# EAGLE design I2CRJ45X8 (EAGLE 9.6.2)

## Sheet 1 of 4
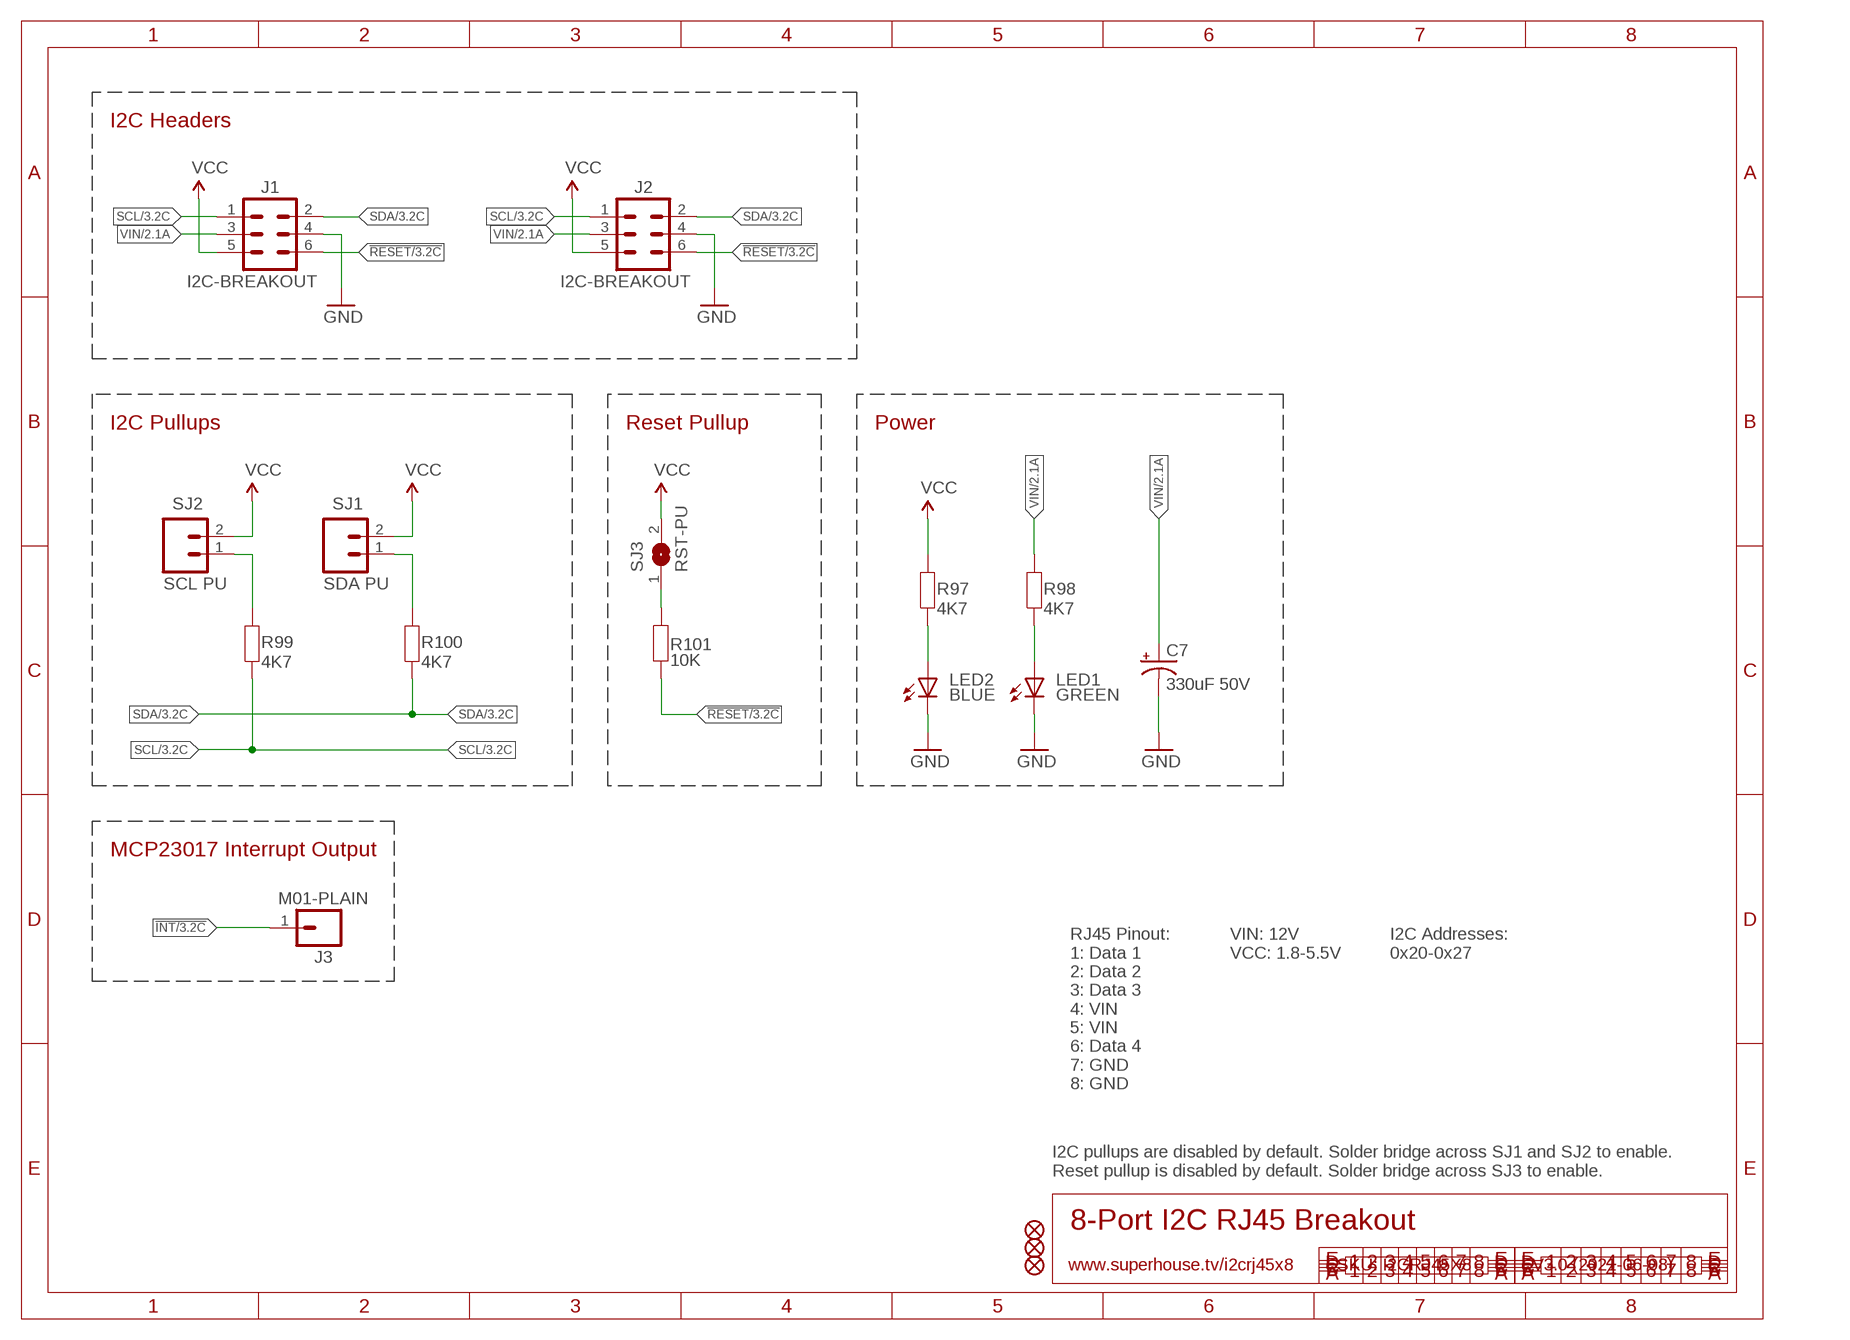
[diagram p0: schematic, sheet 1]

### Parts
C7  330uF 50V  CAP_POLG  [PANASONIC_G]
FID1  FIDUCIAL1X2.5  [FIDUCIAL-1X2.5]
FID2  FIDUCIAL1X2.5  [FIDUCIAL-1X2.5]
FID3  FIDUCIAL1X2.5  [FIDUCIAL-1X2.5]
J1  I2C-BREAKOUT  M02X3-SHROUDED  [2X3-2.54-SHROUDED]
J2  I2C-BREAKOUT  M02X3-SHROUDED  [2X3-2.54-SHROUDED]
J3  M01-PLAIN  [1X01]
LED1  GREEN  LED0603  [LED-0603]
LED2  BLUE  LED0603  [LED-0603]
R97  4K7  RESISTOR0603  [R0603]
R98  4K7  RESISTOR0603  [R0603]
R99  4K7  RESISTOR0603  [R0603]
R100  4K7  RESISTOR0603  [R0603]
R101  10K  RESISTOR0603  [R0603]
SJ1  SDA PU  M02-PIN  [1X02-P]
SJ2  SCL PU  M02-PIN  [1X02-P]
SJ3  RST-PU  SJ-NORMAL  [SJ]

### Nets
!INT: J3.1 ; also sheet 3,4
!RESET: J1.6 J2.6 R101.1 ; also sheet 3,4
GND: C7.- J1.4 J2.4 LED1.C LED2.C ; also sheet 2,3,4
N$1: R99.2 SJ2.1
N$2: R100.2 SJ1.1
N$3: R101.2 SJ3.1
N$7: LED2.A R97.1
N$8: LED1.A R98.1
SCL: J1.1 J2.1 R99.1 ; also sheet 3,4
SDA: J1.2 J2.2 R100.1 ; also sheet 3,4
VCC: J1.5 J2.5 R97.2 SJ1.2 SJ2.2 SJ3.2 ; also sheet 3,4
VIN: C7.+ J1.3 J2.3 R98.2 ; also sheet 2

### Notes on the sheet
- I2C Headers
- I2C Pullups | Reset Pullup | Power
- MCP23017 Interrupt Output
- RJ45 Pinout:
  1: Data 1
  2: Data 2
  3: Data 3
  4: VIN
  5: VIN
  6: Data 4
  7: GND
  8: GND
- VIN: 12V
  VCC: 1.8-5.5V
- I2C Addresses:
  0x20-0x27
- I2C pullups are disabled by default. Solder bridge across SJ1 and SJ2 to enable.
  Reset pullup is disabled by default. Solder bridge across SJ3 to enable.
- 8-Port I2C RJ45 Breakout
- www.superhouse.tv/i2crj45x8 | SKU: I2CRJ45X8 | V3.0 (2021-06-08)

## Sheet 2 of 4
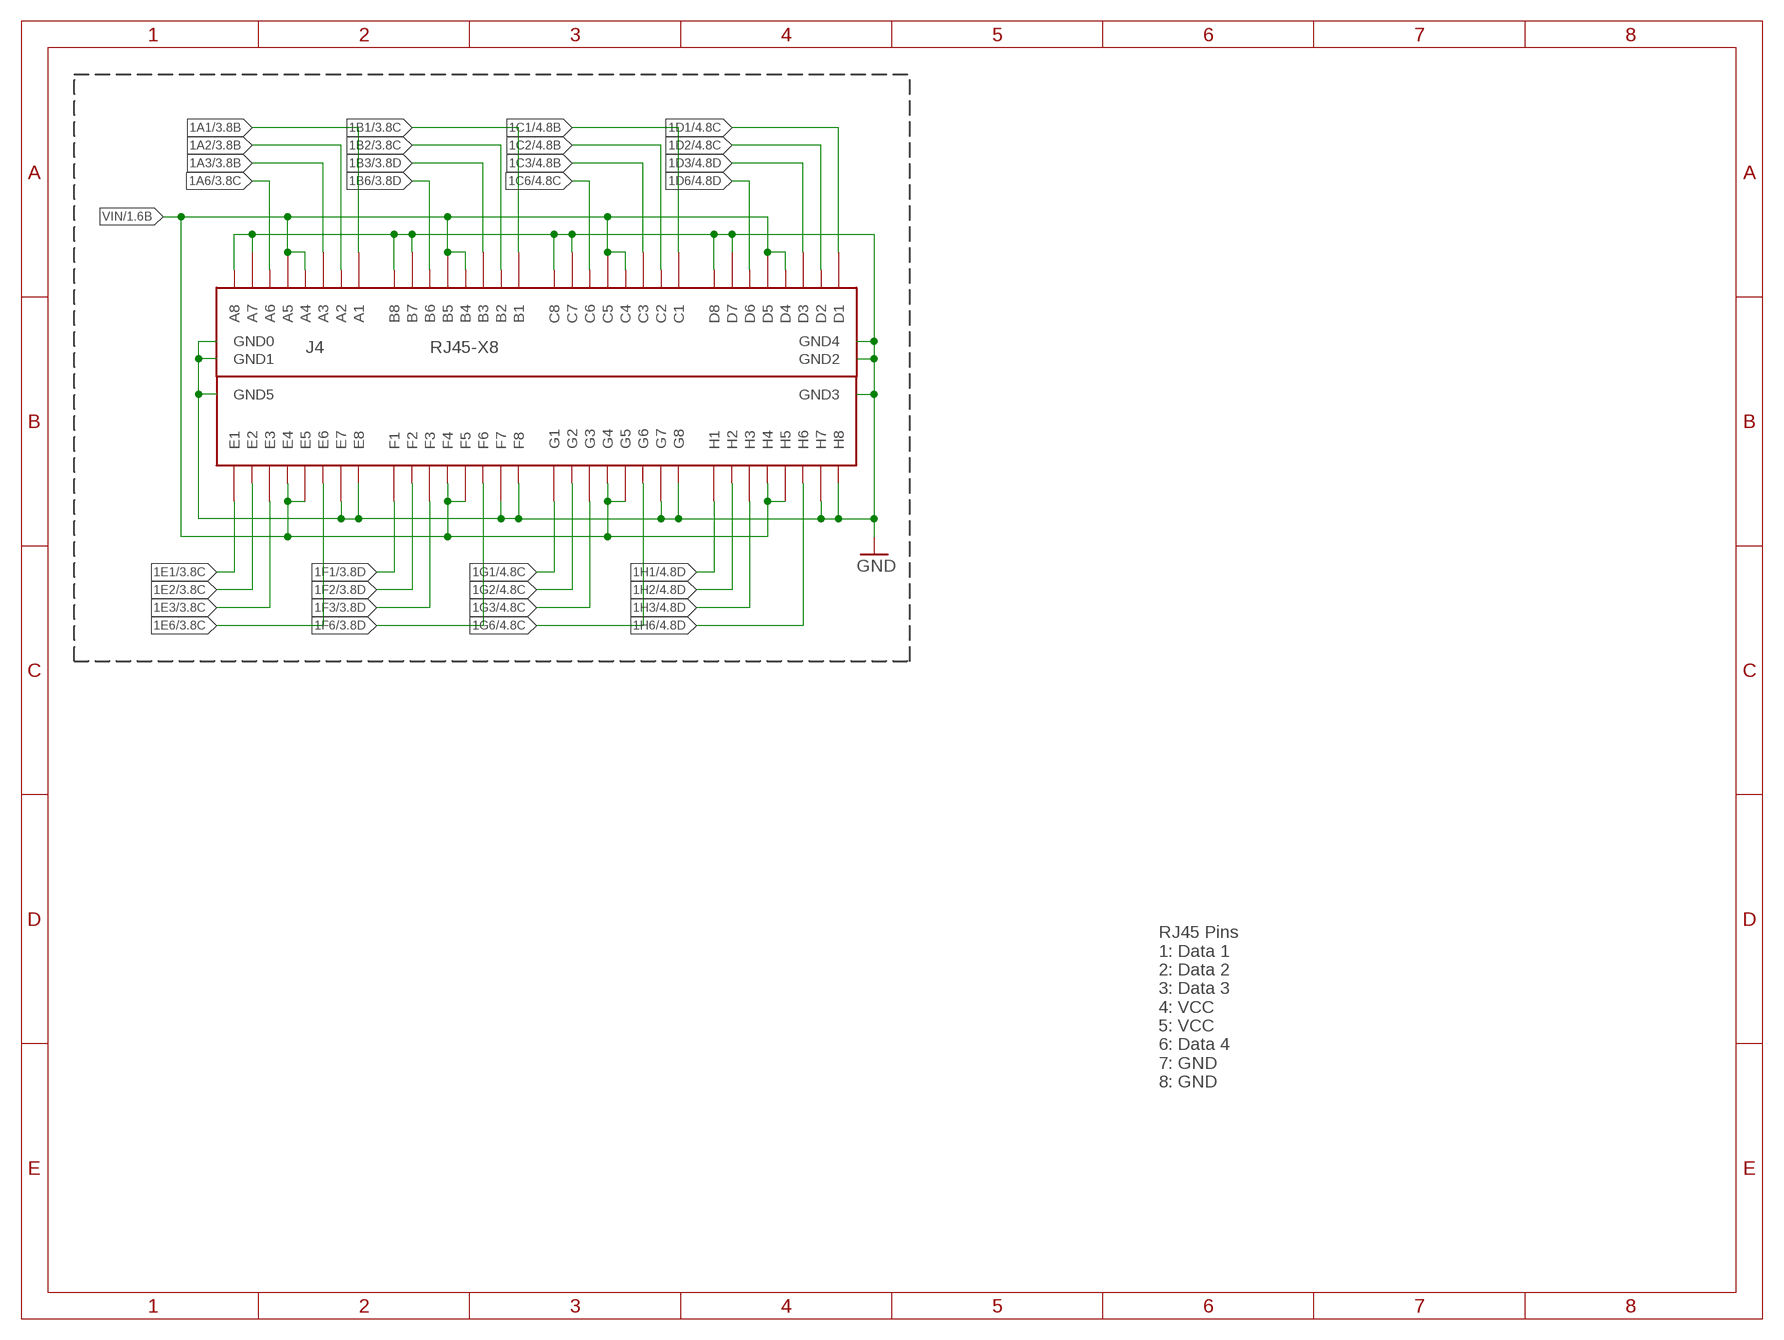
[diagram p1: schematic, sheet 2]

### Parts
J4  RJ45-X8  [RJ45-2X4]

### Nets
1A1: J4.A1 ; also sheet 3
1A2: J4.A2 ; also sheet 3
1A3: J4.A3 ; also sheet 3
1A6: J4.A6 ; also sheet 3
1B1: J4.B1 ; also sheet 3
1B2: J4.B2 ; also sheet 3
1B3: J4.B3 ; also sheet 3
1B6: J4.B6 ; also sheet 3
1C1: J4.C1 ; also sheet 4
1C2: J4.C2 ; also sheet 4
1C3: J4.C3 ; also sheet 4
1C6: J4.C6 ; also sheet 4
1D1: J4.D1 ; also sheet 4
1D2: J4.D2 ; also sheet 4
1D3: J4.D3 ; also sheet 4
1D6: J4.D6 ; also sheet 4
1E1: J4.E1 ; also sheet 3
1E2: J4.E2 ; also sheet 3
1E3: J4.E3 ; also sheet 3
1E6: J4.E6 ; also sheet 3
1F1: J4.F1 ; also sheet 3
1F2: J4.F2 ; also sheet 3
1F3: J4.F3 ; also sheet 3
1F6: J4.F6 ; also sheet 3
1G1: J4.G1 ; also sheet 4
1G2: J4.G2 ; also sheet 4
1G3: J4.G3 ; also sheet 4
1G6: J4.G6 ; also sheet 4
1H1: J4.H1 ; also sheet 4
1H2: J4.H2 ; also sheet 4
1H3: J4.H3 ; also sheet 4
1H6: J4.H6 ; also sheet 4
GND: J4.A7 J4.A8 J4.B7 J4.B8 J4.C7 J4.C8 J4.D7 J4.D8 J4.E7 J4.E8 J4.F7 J4.F8 J4.G7 J4.G8 J4.GND0 J4.GND1 J4.GND2 J4.GND3 J4.GND4 J4.GND5 J4.H7 J4.H8 ; also sheet 1,3,4
VIN: J4.A4 J4.A5 J4.B4 J4.B5 J4.C4 J4.C5 J4.D4 J4.D5 J4.E4 J4.E5 J4.F4 J4.F5 J4.G4 J4.G5 J4.H4 J4.H5 ; also sheet 1

### Notes on the sheet
- RJ45 Pins
  1: Data 1
  2: Data 2
  3: Data 3
  4: VCC
  5: VCC
  6: Data 4
  7: GND
  8: GND

## Sheet 3 of 4
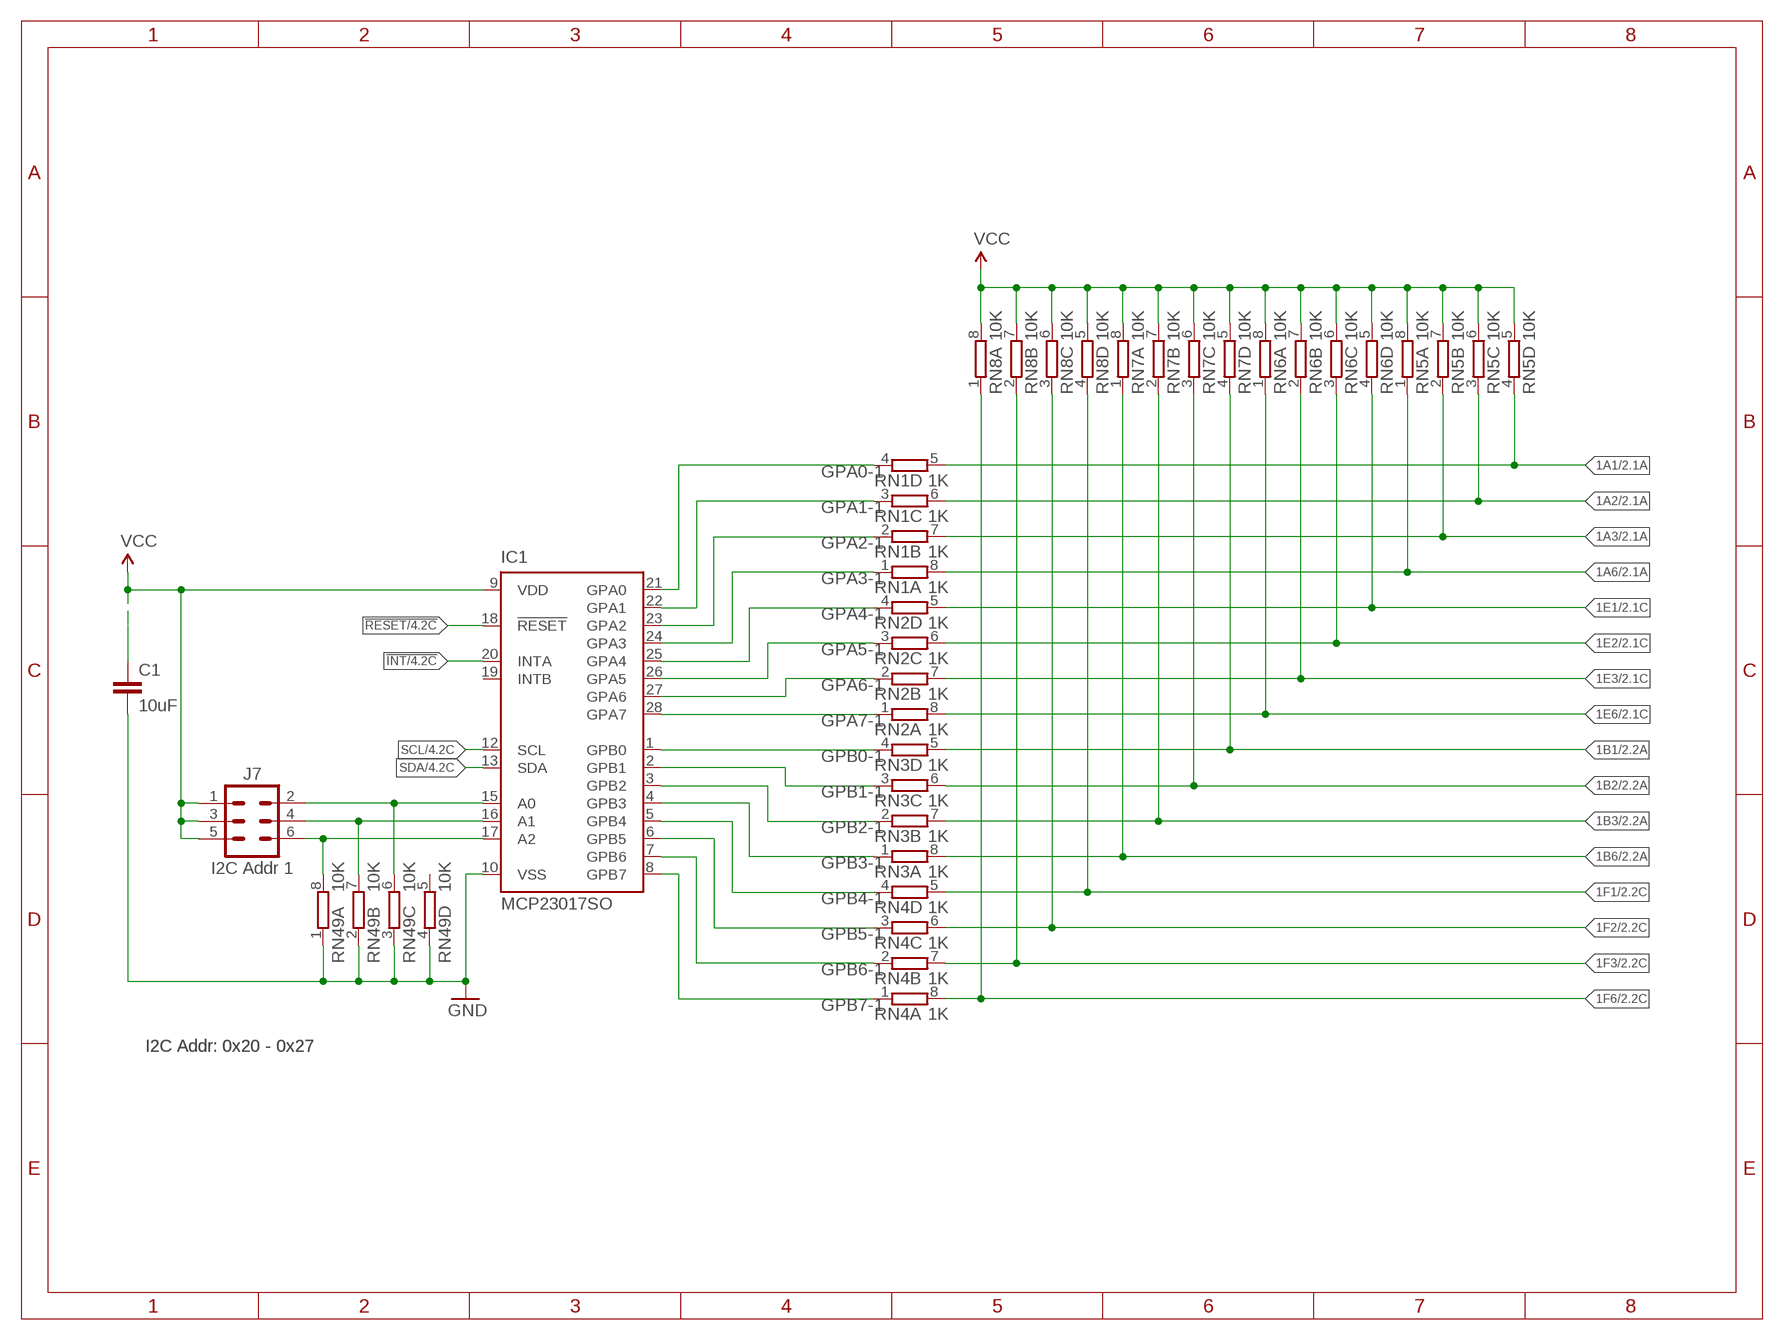
[diagram p2: schematic, sheet 3]

### Parts
C1  10uF  CAP0805  [C0805]
IC1  MCP23017SO  [SO28W]
J7  I2C Addr 1  M02X3-PIN  [2X03-P]
RN1  1K  4R-NCAY16  [CAY16]
RN2  1K  4R-NCAY16  [CAY16]
RN3  1K  4R-NCAY16  [CAY16]
RN4  1K  4R-NCAY16  [CAY16]
RN5  10K  4R-NCAY16  [CAY16]
RN6  10K  4R-NCAY16  [CAY16]
RN7  10K  4R-NCAY16  [CAY16]
RN8  10K  4R-NCAY16  [CAY16]
RN49  10K  4R-NCAY16  [CAY16]

### Nets
1A1: RN1.5 RN5.4 ; also sheet 2
1A2: RN1.6 RN5.3 ; also sheet 2
1A3: RN1.7 RN5.2 ; also sheet 2
1A6: RN1.8 RN5.1 ; also sheet 2
1B1: RN3.5 RN7.4 ; also sheet 2
1B2: RN3.6 RN7.3 ; also sheet 2
1B3: RN3.7 RN7.2 ; also sheet 2
1B6: RN3.8 RN7.1 ; also sheet 2
1E1: RN2.5 RN6.4 ; also sheet 2
1E2: RN2.6 RN6.3 ; also sheet 2
1E3: RN2.7 RN6.2 ; also sheet 2
1E6: RN2.8 RN6.1 ; also sheet 2
1F1: RN4.5 RN8.4 ; also sheet 2
1F2: RN4.6 RN8.3 ; also sheet 2
1F3: RN4.7 RN8.2 ; also sheet 2
1F6: RN4.8 RN8.1 ; also sheet 2
!INT: IC1.20(INTA) ; also sheet 1,4
!RESET: IC1.18(!RESET) ; also sheet 1,4
GND: C1.2 IC1.10(VSS) RN49.1 RN49.2 RN49.3 RN49.4 ; also sheet 1,2,4
GPA0-1: IC1.21(GPA0) RN1.4
GPA1-1: IC1.22(GPA1) RN1.3
GPA2-1: IC1.23(GPA2) RN1.2
GPA3-1: IC1.24(GPA3) RN1.1
GPA4-1: IC1.25(GPA4) RN2.4
GPA5-1: IC1.26(GPA5) RN2.3
GPA6-1: IC1.27(GPA6) RN2.2
GPA7-1: IC1.28(GPA7) RN2.1
GPB0-1: IC1.1(GPB0) RN3.4
GPB1-1: IC1.2(GPB1) RN3.3
GPB2-1: IC1.3(GPB2) RN3.2
GPB3-1: IC1.4(GPB3) RN3.1
GPB4-1: IC1.5(GPB4) RN4.4
GPB5-1: IC1.6(GPB5) RN4.3
GPB6-1: IC1.7(GPB6) RN4.2
GPB7-1: IC1.8(GPB7) RN4.1
N$4: IC1.17(A2) J7.6 RN49.8
N$5: IC1.16(A1) J7.4 RN49.7
N$6: IC1.15(A0) J7.2 RN49.6
SCL: IC1.12(SCL) ; also sheet 1,4
SDA: IC1.13(SDA) ; also sheet 1,4
VCC: C1.1 IC1.9(VDD) J7.1 J7.3 J7.5 RN5.5 RN5.6 RN5.7 RN5.8 RN6.5 RN6.6 RN6.7 RN6.8 RN7.5 RN7.6 RN7.7 RN7.8 RN8.5 RN8.6 RN8.7 RN8.8 ; also sheet 1,4
Unconnected: IC1.19(INTB) RN49.5

### Notes on the sheet
- I2C Addr: 0x20 - 0x27 | I2C Addr: 0x20 - 0x27

## Sheet 4 of 4
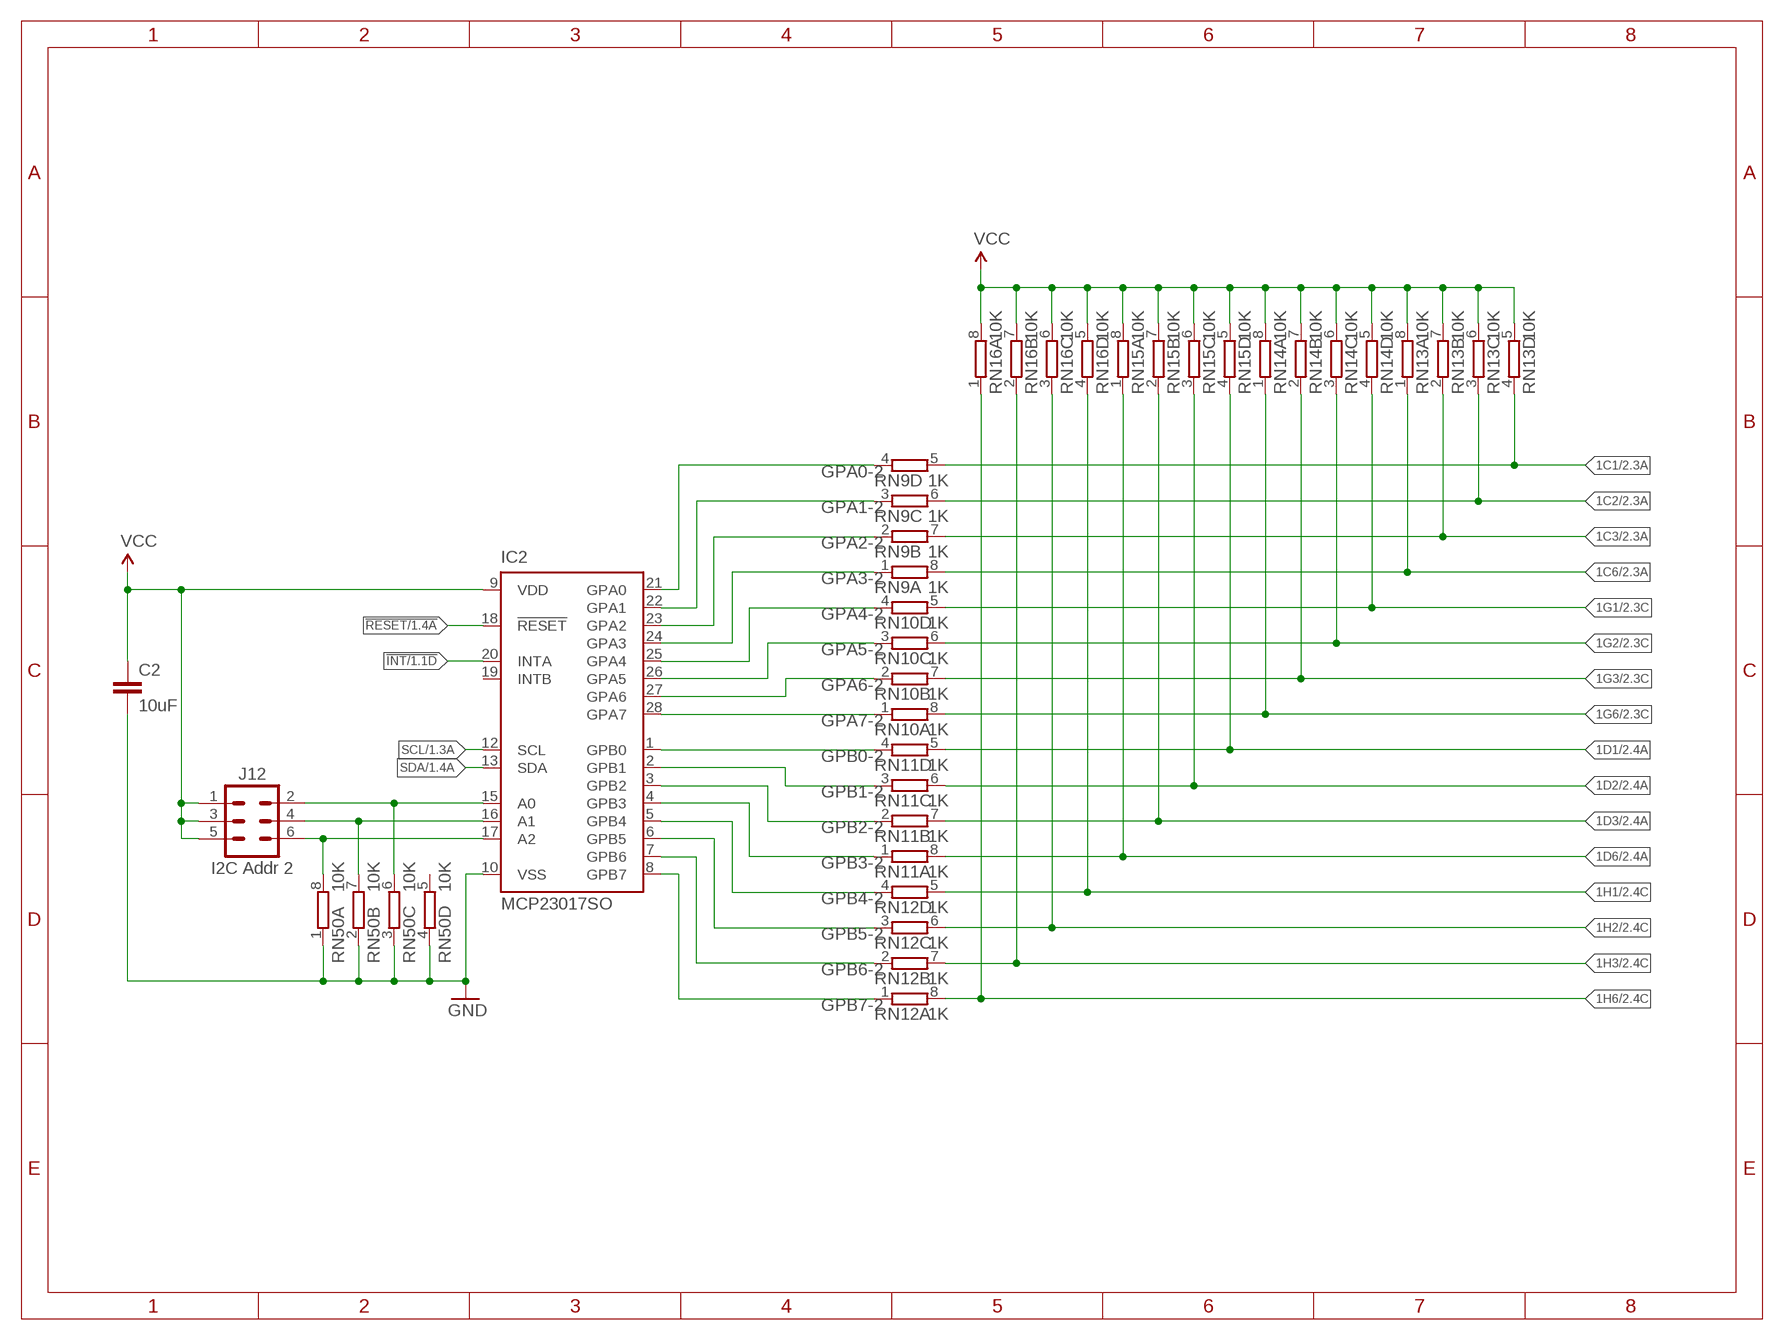
[diagram p3: schematic, sheet 4]

### Parts
C2  10uF  CAP0805  [C0805]
IC2  MCP23017SO  [SO28W]
J12  I2C Addr 2  M02X3-PIN  [2X03-P]
RN9  1K  4R-NCAY16  [CAY16]
RN10  1K  4R-NCAY16  [CAY16]
RN11  1K  4R-NCAY16  [CAY16]
RN12  1K  4R-NCAY16  [CAY16]
RN13  10K  4R-NCAY16  [CAY16]
RN14  10K  4R-NCAY16  [CAY16]
RN15  10K  4R-NCAY16  [CAY16]
RN16  10K  4R-NCAY16  [CAY16]
RN50  10K  4R-NCAY16  [CAY16]

### Nets
1C1: RN9.5 RN13.4 ; also sheet 2
1C2: RN9.6 RN13.3 ; also sheet 2
1C3: RN9.7 RN13.2 ; also sheet 2
1C6: RN9.8 RN13.1 ; also sheet 2
1D1: RN11.5 RN15.4 ; also sheet 2
1D2: RN11.6 RN15.3 ; also sheet 2
1D3: RN11.7 RN15.2 ; also sheet 2
1D6: RN11.8 RN15.1 ; also sheet 2
1G1: RN10.5 RN14.4 ; also sheet 2
1G2: RN10.6 RN14.3 ; also sheet 2
1G3: RN10.7 RN14.2 ; also sheet 2
1G6: RN10.8 RN14.1 ; also sheet 2
1H1: RN12.5 RN16.4 ; also sheet 2
1H2: RN12.6 RN16.3 ; also sheet 2
1H3: RN12.7 RN16.2 ; also sheet 2
1H6: RN12.8 RN16.1 ; also sheet 2
!INT: IC2.20(INTA) ; also sheet 1,3
!RESET: IC2.18(!RESET) ; also sheet 1,3
GND: C2.2 IC2.10(VSS) RN50.1 RN50.2 RN50.3 RN50.4 ; also sheet 1,2,3
GPA0-2: IC2.21(GPA0) RN9.4
GPA1-2: IC2.22(GPA1) RN9.3
GPA2-2: IC2.23(GPA2) RN9.2
GPA3-2: IC2.24(GPA3) RN9.1
GPA4-2: IC2.25(GPA4) RN10.4
GPA5-2: IC2.26(GPA5) RN10.3
GPA6-2: IC2.27(GPA6) RN10.2
GPA7-2: IC2.28(GPA7) RN10.1
GPB0-2: IC2.1(GPB0) RN11.4
GPB1-2: IC2.2(GPB1) RN11.3
GPB2-2: IC2.3(GPB2) RN11.2
GPB3-2: IC2.4(GPB3) RN11.1
GPB4-2: IC2.5(GPB4) RN12.4
GPB5-2: IC2.6(GPB5) RN12.3
GPB6-2: IC2.7(GPB6) RN12.2
GPB7-2: IC2.8(GPB7) RN12.1
N$9: IC2.15(A0) J12.2 RN50.6
N$10: IC2.16(A1) J12.4 RN50.7
N$11: IC2.17(A2) J12.6 RN50.8
SCL: IC2.12(SCL) ; also sheet 1,3
SDA: IC2.13(SDA) ; also sheet 1,3
VCC: C2.1 IC2.9(VDD) J12.1 J12.3 J12.5 RN13.5 RN13.6 RN13.7 RN13.8 RN14.5 RN14.6 RN14.7 RN14.8 RN15.5 RN15.6 RN15.7 RN15.8 RN16.5 RN16.6 RN16.7 RN16.8 ; also sheet 1,3
Unconnected: IC2.19(INTB) RN50.5

## Library data of the parts
C1 C2 = SuperHouse-Capacitors:CAP: Capacitor Standard ceramic capacitor
C7 = SuperHouse-Capacitors:CAP_POL: Capacitor Polarized These are standard SMD and PTH capacitors. Normally 10uF, 47uF, and 100uF in electrolytic and tantalum varieties. Always verify the external diameter of the through hole cap, it varies with capacity, voltage, and manufacturer. The EIA devices should be standard.
FID1-FID3 = SuperHouse-Symbols:FIDUCIAL: Fiducial Alignment Points Various fiducial points for machine vision alignment.
IC1 IC2 = SuperHouse-ICs:MCP23017: http://ww1.microchip.com/downloads/en/DeviceDoc/21952a.pdf Source: http://ww1.microchip.com/downloads/en/DeviceDoc/21952a.pdf
J1 J2 J7 J12 = SuperHouse-Connectors:M02X3: M6 header in 2x3 format
J3 = SuperHouse-Connectors:M01: 1-way header Standard 1x1 header
J4 = SuperHouse-Connectors:RJ45-X8: 8-way RJ45 socket, PCB mount. 2 rows of 4.
LED1 LED2 = SuperHouse-LEDs:LED: LEDs in various sizes including 5mm and 3mm PTH, and 0402, 0603, 0805, etc SMT
R97-R101 = SuperHouse-Resistors:RESISTOR: Resistors in both surface-mount and through-hole versions.
RN1-RN16 RN49 RN50 = SuperHouse-Resistors:4R-N: Array Chip Resistor Source: RS Component / Phycomp
SJ1 SJ2 = SuperHouse-Connectors:M02: 2-way header Standard 1x2 header, and screw terminal variations
SJ3 = SuperHouse-Jumpers:SJ: SMD solder jumper, normally-open. Add solder to close the connection.

## Board
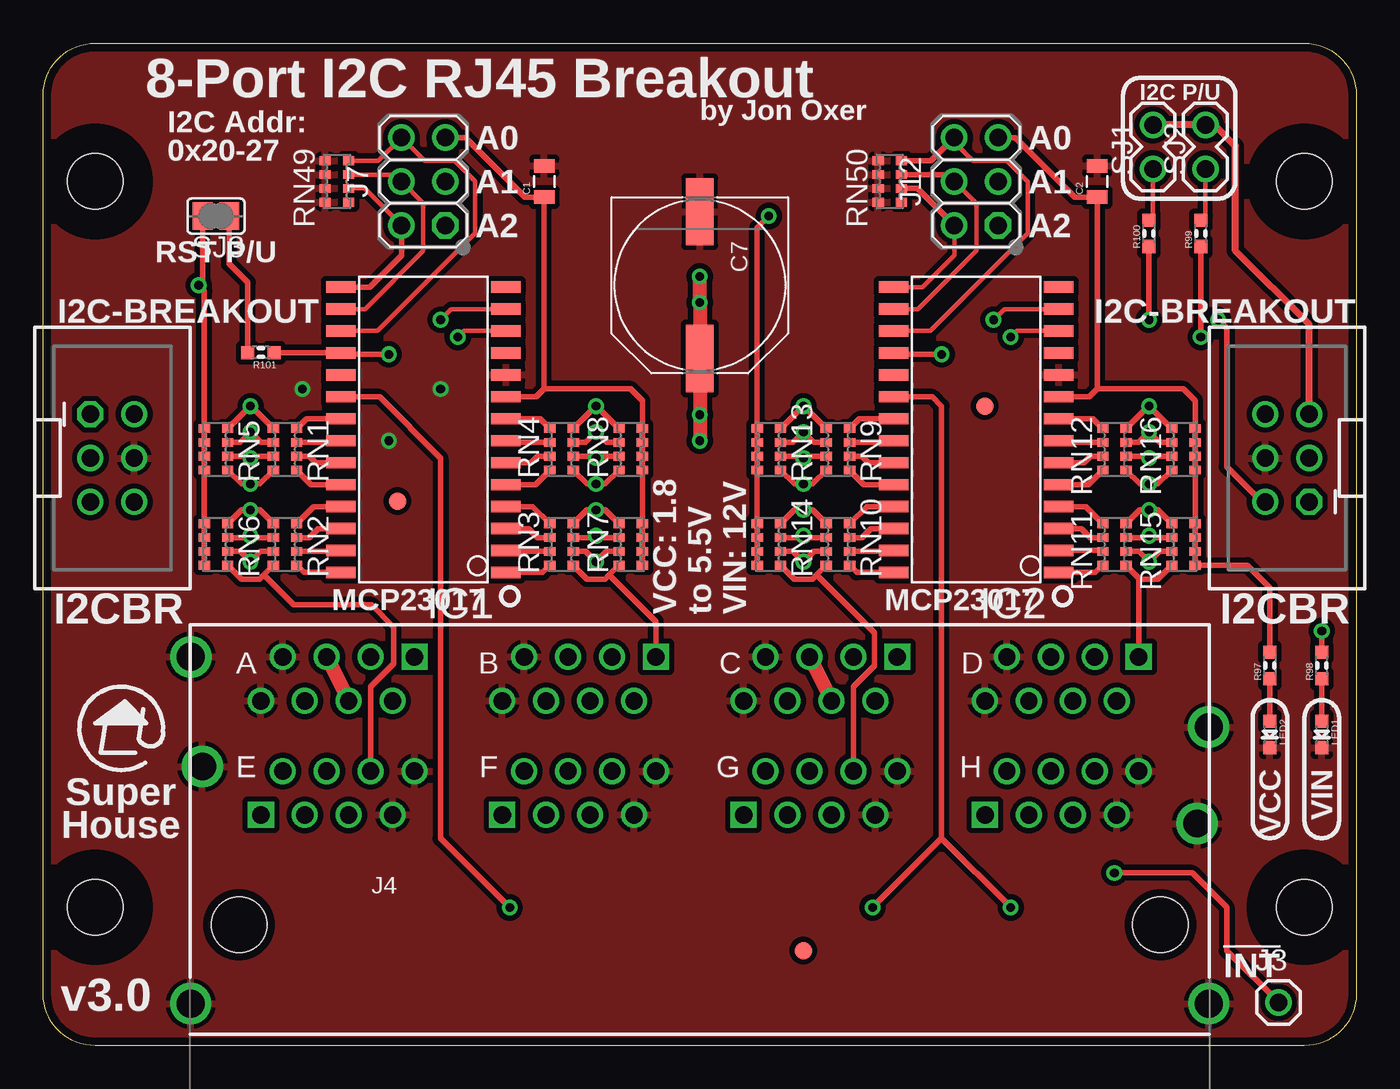
[diagram p4: board, top side]
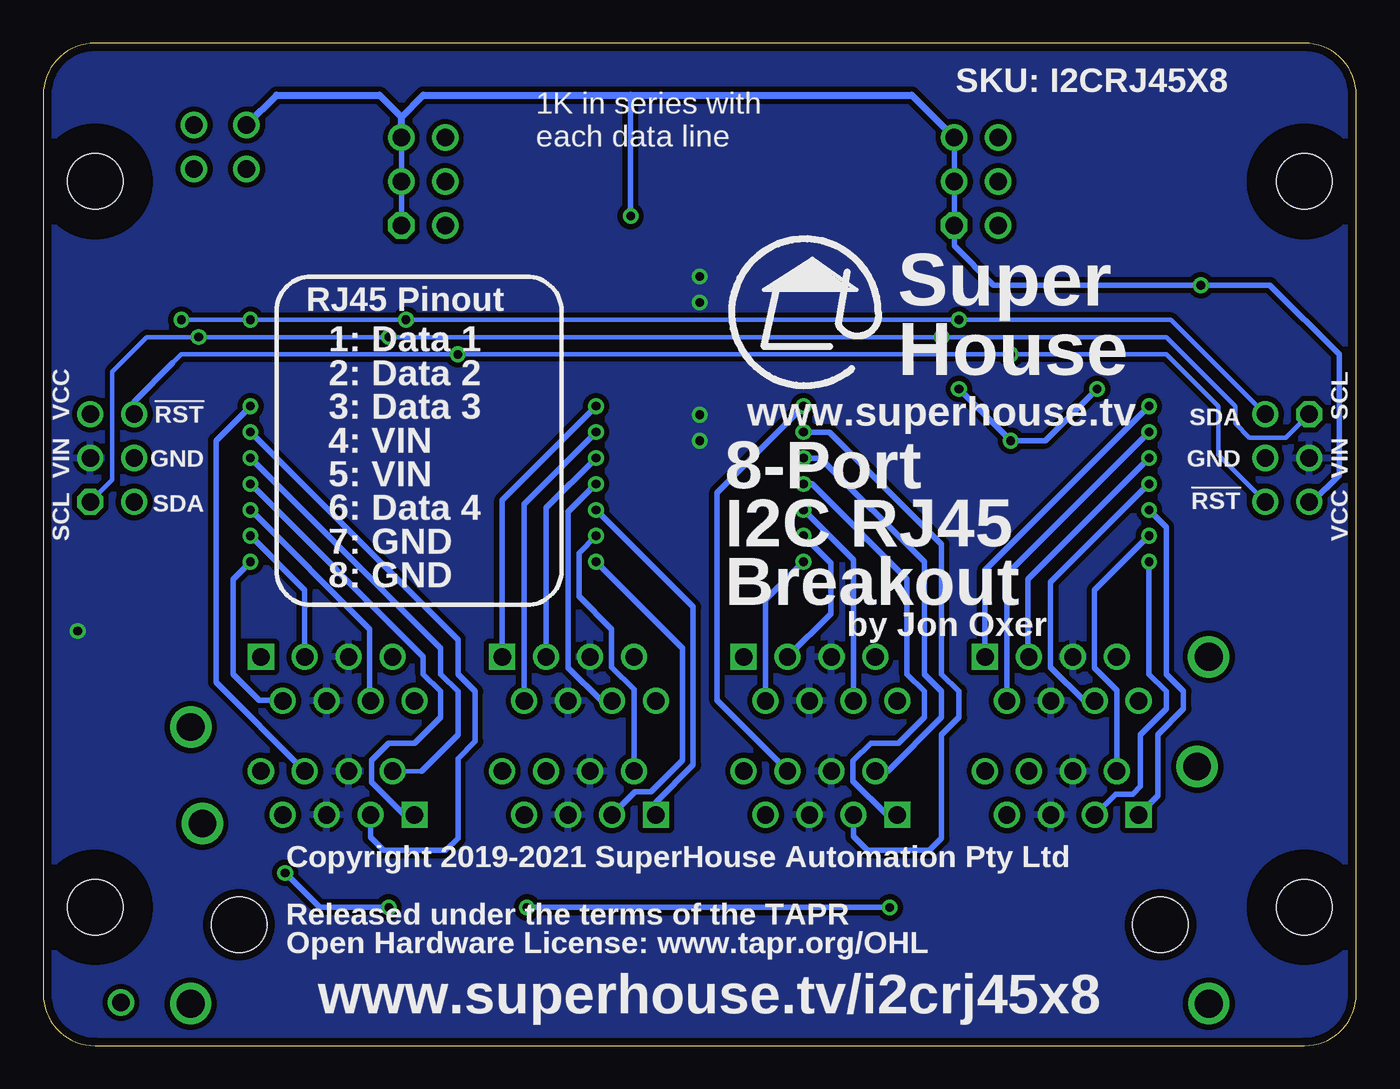
[diagram p5: board, bottom side, seen from below]

Size 76 x 58 mm. Coordinates in mm from the lower left corner, seen from the top.
Outline: 3,0 arc-90 0,3 0,55 arc-90 3,58 73,58 arc-90 76,55 76,3 arc-90 73,0 3,0
Copper layers (1*16): Top 0.035mm / dielectric 1.5mm / Bottom 0.035mm
Design rules "default *": minimum track width 10mil, minimum drill 0.5mm, track to track 12mil, track to pad 12mil, pad to pad 12mil, via to via 12mil, smd to smd 8mil, copper to edge 18mil, drill to drill 8mil, minimum pad ring 10mil, minimum via ring 8mil, stop-mask expansion 4mil, vias tented up to drill 25mil, thermal gap 10mil
Holes 3.2 mm at 3,8 73,8 73,50 3,50
tRestrict: area -0.2,4.8 to 6.2,11.2; area 69.8,4.8 to 76.2,11.2; area 69.8,46.8 to 76.2,53.2; area -0.2,46.8 to 6.2,53.2
bRestrict: area -0.2,4.8 to 6.2,11.2; area 69.8,4.8 to 76.2,11.2; area 69.8,46.8 to 76.2,53.2; area -0.2,46.8 to 6.2,53.2

### Footprints (pad centres in the part's own frame; a part is rotated, then mirrored left to right if it is on the bottom)
C0805 = smd 0.8 x 1.2: 1 -0.9,0; 2 0.9,0
PANASONIC_G = smd 3.9 x 1.6: + 4.25,0; - -4.25,0
FIDUCIAL-1X2.5 = smd 1 x 1: 1 0,0
SO28W = smd 0.65 x 1.7: 1 -7.62,-4.78; 2 -6.35,-4.78; 3 -5.08,-4.78; 4 -3.81,-4.78; 5 -2.54,-4.78; 6 -1.27,-4.78; 7 0,-4.78; 8 1.27,-4.78; 9 2.54,-4.78; 10 3.81,-4.78; 11 5.08,-4.78; 12 6.35,-4.78; 13 7.62,-4.78; 14 8.89,-4.78; 15 8.89,4.78; 16 7.62,4.78; 17 6.35,4.78; 18 5.08,4.78; 19 3.81,4.78; 20 2.54,4.78; 21 1.27,4.78; 22 0,4.78; 23 -1.27,4.78; 24 -2.54,4.78; 25 -3.81,4.78; 26 -5.08,4.78; 27 -6.35,4.78; 28 -7.62,4.78
2X3-2.54-SHROUDED = drill 1 octagon: 1 -2.54,-1.27 | drill 1: 2 -2.54,1.27; 3 0,-1.27; 4 0,1.27; 5 2.54,-1.27; 6 2.54,1.27
1X01 = drill 1.016: 1 0,0
RJ45-2X4 = drill 1 square: A1 -16.51,15.49; B1 -2.54,15.49; C1 11.43,15.49; D1 25.4,15.49; E1 -25.4,6.35; F1 -11.43,6.35; G1 2.54,6.35; H1 16.51,6.35 | drill 1: A2 -17.78,12.95; A3 -19.05,15.49; A4 -20.32,12.95; A5 -21.59,15.49; A6 -22.86,12.95; A7 -24.13,15.49; A8 -25.4,12.95; B2 -3.81,12.95; B3 -5.08,15.49; B4 -6.35,12.95; B5 -7.62,15.49; B6 -8.89,12.95; B7 -10.16,15.49; B8 -11.43,12.95; C2 10.16,12.95; C3 8.89,15.49; C4 7.62,12.95; C5 6.35,15.49; C6 5.08,12.95; C7 3.81,15.49; C8 2.54,12.95; D2 24.13,12.95; D3 22.86,15.49; D4 21.59,12.95; D5 20.32,15.49; D6 19.05,12.95; D7 17.78,15.49; D8 16.51,12.95; E2 -24.13,8.89; E3 -22.86,6.35; E4 -21.59,8.89; E5 -20.32,6.35; E6 -19.05,8.89; E7 -17.78,6.35; E8 -16.51,8.89; F2 -10.16,8.89; F3 -8.89,6.35; F4 -7.62,8.89; F5 -6.35,6.35; F6 -5.08,8.89; F7 -3.81,6.35; F8 -2.54,8.89; G2 3.81,8.89; G3 5.08,6.35; G4 6.35,8.89; G5 7.62,6.35; G6 8.89,8.89; G7 10.16,6.35; G8 11.43,8.89; H2 17.78,8.89; H3 19.05,6.35; H4 20.32,8.89; H5 21.59,6.35; H6 22.86,8.89; H7 24.13,6.35; H8 25.4,8.89 | drill 1.6: GND0 29.464,-4.572; GND1 28.79,5.85; GND2 -29.46,15.5; GND3 -28.79,9.15; GND4 -29.464,-4.572; GND5 29.46,11.43 | hole 3.2: 26.67,0; -26.67,0
2X03-P = drill 1.016 octagon: 1 -2.54,-1.27 | drill 1.016: 2 -2.54,1.27; 3 0,-1.27; 4 0,1.27; 5 2.54,-1.27; 6 2.54,1.27
LED-0603 = smd 0.762 x 0.762: A -0.762,0; C 0.762,0
R0603 = smd 0.762 x 0.762: 1 -0.762,0; 2 0.762,0
CAY16 = smd 0.5 x 0.65: 1 -1.2,-0.675; 2 -0.4,-0.675; 3 0.4,-0.675; 4 1.2,-0.675; 5 1.2,0.675; 6 0.4,0.675; 7 -0.4,0.675; 8 -1.2,0.675
1X02-P = drill 1.016: 1 -1.27,0; 2 1.27,0
SJ = smd 1.168 x 1.6: 1 -0.762,0; 2 0.762,0

### Placement (x,y rotation side)
C1  29,50 90 top
C2  61,50 90 top
C7  38,44 270 top
FID1  20.5,31.5 0 top
FID2  54.5,37 0 top
FID3  44,5.5 0 top
IC1  22,35 90 top
IC2  54,35 90 top
J1  4,34 270 top
J2  72,34 90 top
J3  71.5,2.5 0 top
J4  38,7 0 top
J7  22,50 90 top
J12  54,50 90 top
LED1  74,18 270 top
LED2  71,18 270 top
R97  71,22 90 top
R98  74,22 90 top
R99  67,47 90 top
R100  64,47 90 top
R101  12.6,40.1 180 top
RN1  14,34.5 90 top
RN2  14,29 90 top
RN3  30,29 270 top
RN4  30,34.5 270 top
RN5  10,34.5 90 top
RN6  10,29 90 top
RN7  34,29 270 top
RN8  34,34.5 270 top
RN9  46,34.5 90 top
RN10  46,29 90 top
RN11  62,29 270 top
RN12  62,34.5 270 top
RN13  42,34.5 90 top
RN14  42,29 90 top
RN15  66,29 270 top
RN16  66,34.5 270 top
RN49  17,50 270 top
RN50  49,50 270 top
SJ1  64.23,52 90 top
SJ2  67.27,52 90 top
SJ3  10,48 180 top

### Tracks (layer width: path | path; a pad name or v marks a point on that pad's centre or on a via)
1A1  (via drill 0.5)
  Top 0.305: RN1.5 12.03,37 v12,37 11.97,37 RN5.4
  Bottom 0.305: v12,37 21.49,27.51 J4.A1
1A2  (via drill 0.5)
  Top 0.305: RN1.6 12.6,34.9 v12,35.5 11.4,34.9 RN5.3
  Bottom 0.305: v12,35.5 20.22,27.28 J4.A2
1A3  (via drill 0.5)
  Top 0.305: RN1.7 12.1,34.1 v12,34 11.9,34.1 RN5.2
  Bottom 0.254: J4.A3 19,22.54
  Bottom 0.305: v12,34 19,27 19,22.54
1A6  (via drill 0.5)
  Top 0.305: RN1.8 12.53,32.5 v12,32.5 11.47,32.5 RN5.1
  Bottom 0.305: v12,32.5 17.7,26.8 17.7,21.9 15.75,19.95 J4.A6
1B1
  Top 0.305: RN3.5 31.48,27 32.52,27 32.76,27.24 | RN7.4 32.76,27.24 | J4.B1 35.46,24.54 32.76,27.24
1B2  (via drill 0.5)
  Top 0.305: RN3.6 31.4,28.6 v32,28 32.6,28.6 RN7.3
  Bottom 0.305: J4.B2 34.19,25.81 v32,28
1B3  (via drill 0.5)
  Top 0.305: RN3.7 31.9,29.4 v32,29.5 32.1,29.4 RN7.2
  Bottom 0.305: v32,29.5 30.42,27.92 30.42,24.99 J4.B3
1B6  (via drill 0.5)
  Top 0.305: RN3.8 31.48,31 v32,31 32.52,31 RN7.1
  Bottom 0.305: J4.B6 29.11,28.11 v32,31
1C1  (via drill 0.5)
  Top 0.305: RN9.5 44.02,37 v44,37 43.98,37 RN13.4
  Bottom 0.305: v44,37 49.43,31.57 J4.C1
1C2  (via drill 0.5)
  Top 0.305: RN9.6 44.6,34.9 v44,35.5 43.4,34.9 RN13.3
  Bottom 0.254: J4.C2 48.18,19.97
  Bottom 0.305: v44,35.5 48.18,31.32 48.18,19.97
1C3  (via drill 0.5)
  Top 0.305: RN9.7 44.1,34.1 v44,34 43.9,34.1 RN13.2
  Bottom 0.305: J4.C3 46.89,31.11 v44,34
1C6  (via drill 0.5)
  Top 0.305: RN13.1 43.48,32.5 v44,32.5 44.52,32.5 RN9.8
  Bottom 0.305: J4.C6 43.69,19.95 45.61,21.87 45.61,30.89 v44,32.5
1D1
  Top 0.305: 63.48,27 RN11.5 | RN15.4 64.53,27 63.48,27 | J4.D1 63.4,26.93 63.48,27
1D2  (via drill 0.5)
  Top 0.305: RN11.6 63.4,28.6 v64,28 64.6,28.6 RN15.3
  Bottom 0.305: J4.D2 62.18,20 63.5,20 65,21.5 65,27 v64,28
1D3  (via drill 0.5)
  Top 0.305: RN15.2 64.1,29.4 v64,29.5 63.9,29.4 RN11.7
  Bottom 0.305: v64,29.5 60.86,26.36 J4.D3
1D6  (via drill 0.5)
  Top 0.305: RN15.1 64.53,31 v64,31 63.48,31 RN11.8
  Bottom 0.254: J4.D6 57.1,20
  Bottom 0.305: v64,31 57.1,24.1 57.1,20
1E1  (via drill 0.5)
  Top 0.305: RN2.5 12.53,31 v12,31 11.47,31 RN6.4
  Bottom 0.305: J4.E1 11.5,14.45 11.5,18 10,19.5 10,20.5 11,21.5 11,30 v12,31
1E2  (via drill 0.5)
  Top 0.305: RN2.6 12.1,29.4 v12,29.5 11.9,29.4 RN6.3
  Bottom 0.305: v12,29.5 15.16,26.34 15.16,21.86 13.87,20.57 J4.E2
1E3  (via drill 0.5)
  Top 0.305: RN2.7 12.6,28.6 v12,28 11.4,28.6 RN6.2
  Bottom 0.305: J4.E3 13.93,14.56 12.94,14.56 12.5,15 12.5,18 11,19.5 11,20.5 12,21.5 v12,28
1E6
  Top 0.305: RN6.1 11.47,27 12.53,27 12.76,27.24 | RN2.8 12.76,27.24 | J4.E6 18.95,20.78 20.28,22.11 20.28,24.22 19,25.5 14.5,25.5 12.76,27.24
1F1  (via drill 0.5)
  Top 0.305: RN4.5 31.48,32.5 v32,32.5 32.52,32.5 RN8.4
  Bottom 0.305: v32,32.5 31.5,32.5 26,27 26,21.5 25,20.5 25,19 26.5,17.5 28.1,17.5 29.13,16.47 29.13,15.3 27.18,13.35 J4.F1
1F2  (via drill 0.5)
  Top 0.305: RN4.6 31.9,34.1 v32,34 32.1,34.1 RN8.3
  Bottom 0.305: J4.F2 27.11,15.89 24,19 24,20.5 25,21.5 25,28 31,34 v32,34
1F3  (via drill 0.5)
  Top 0.305: RN4.7 31.4,34.9 v32,35.5 32.6,34.9 RN8.2
  Bottom 0.305: J4.F3 29.11,12.11 28.3,11.3 24.7,11.3 24,12 24,18 23,19 23,20.5 24,21.5 24,29 30.5,35.5 v32,35.5
1F6  (via drill 0.5)
  Top 0.305: RN4.8 31.98,37 v32,37 32.02,37 RN8.1
  Bottom 0.254: J4.F6 32.92,15.92
  Bottom 0.305: 32.92,15.92 37,20 37,32 v32,37
1G1  (via drill 0.5)
  Top 0.305: RN10.5 44.52,31 v44,31 43.48,31 RN14.4
  Bottom 0.305: J4.G1 40.54,14.1 38.39,16.25 38.39,25.39 v44,31
1G2  (via drill 0.5)
  Top 0.305: RN10.6 44.1,29.4 v44,29.5 43.9,29.4 RN14.3
  Bottom 0.305: J4.G2 41.81,20.61 43.1,21.9 43.1,24.1 45,26 45,28.5 v44,29.5
1G3  (via drill 0.5)
  Top 0.305: RN14.2 43.4,28.6 v44,28 44.6,28.6 RN10.7
  Bottom 0.305: J4.G3 41.75,14.68 40.82,14.68 39,16.5 39,23 v44,28
1G6
  Top 0.305: RN14.1 43.48,27 44.52,27 44.76,27.24 | RN10.8 44.76,27.24 | J4.G6 46.89,20.78 48.1,21.99 48.1,23.9 44.76,27.24
1H1  (via drill 0.5)
  Top 0.305: RN16.4 64.53,32.5 v64,32.5 63.48,32.5 RN12.5
  Bottom 0.305: J4.H1 55.12,13.35 57,15.23 57,16.5 56,17.5 54.5,17.5 53,19 53,20.5 54,21.5 54,22.5 v64,32.5
1H2  (via drill 0.5)
  Top 0.305: RN16.3 64.1,34.1 v64,34 63.9,34.1 RN12.6
  Bottom 0.254: J4.H2 54.11,15.89
  Bottom 0.305: 54.11,15.89 52,18 52,20.5 53,21.5 53,23 v64,34
1H3  (via drill 0.5)
  Top 0.305: RN16.2 64.6,34.9 v64,35.5 63.4,34.9 RN12.7
  Bottom 0.305: J4.H3 57.05,12.05 56.3,11.3 52.7,11.3 52,12 52,16.6 51,17.6 51,20.5 52,21.5 52,23.5 v64,35.5
1H6  (via drill 0.5)
  Top 0.305: RN12.8 63.98,37 v64,37 64.03,37 RN16.1
  Bottom 0.305: J4.H6 66,21.03 66,35 v64,37
!INT  (via drill 0.5)
  Top 0.305: IC1.20 19.46,37.54 23,34 23,12 v27,8 | IC2.20 51.46,37.54 52,37 52,12 | v48,8 52,12 | J3.1 68.5,5.5 68.5,8 66.5,10 v62,10 | 52,12 v56,8
  Bottom 0.305: v48,8 v27,8 | v62,10 60,8 v56,8
!RESET  (via drill 0.5)
  Top 0.254: 17.3,40 IC1.18
  Top 0.305: v52,40 49.3,40 IC2.18 | v20,40 17.3,40 | IC1.18 13.38,40.08 R101.1
  Bottom 0.254: 68.5,39.5 68,40 v52,40 v20,40 11,40 8,37 8,34.19 J1.6
  Bottom 0.305: J2.6 70.73,37.27 68.5,39.5
GND  (via drill 0.5)
  Bottom 0.305: v23,38 v20,35 18,35 v15,38
  pour Top: 73,0 arc90 76,3 76,55 arc90 73,58 3,58 arc90 0,55 0,3 arc90 3,0
GPA0-1
  Top 0.305: IC1.21 15.24,36.27 RN1.4
GPA0-2
  Top 0.305: IC2.21 47.24,36.27 RN9.4
GPA1-1
  Top 0.305: IC1.22 17.12,34.9 RN1.3
GPA1-2
  Top 0.305: IC2.22 49.12,34.9 RN9.3
GPA2-1
  Top 0.305: RN1.2 15.4,34.1 15.77,33.73 IC1.23
GPA2-2
  Top 0.305: IC2.23 47.77,33.73 47.4,34.1 RN9.2
GPA3-1
  Top 0.305: IC1.24 15.52,32.46 RN1.1
GPA3-2
  Top 0.305: IC2.24 47.52,32.46 RN9.1
GPA4-1
  Top 0.305: RN2.4 15.66,31.19 IC1.25
GPA4-2
  Top 0.305: IC2.25 47.66,31.19 RN10.4
GPA5-1
  Top 0.305: IC1.26 15.92,29.92 15.4,29.4 RN2.3
GPA5-2
  Top 0.305: IC2.26 47.92,29.92 47.4,29.4 RN10.3
GPA6-1
  Top 0.305: IC1.27 17.17,28.6 RN2.2
GPA6-2
  Top 0.305: RN10.2 49.17,28.6 IC2.27
GPA7-1
  Top 0.305: IC1.28 15.1,27.38 RN2.1
GPA7-2
  Top 0.305: IC2.28 47.09,27.38 RN10.1
GPB0-1
  Top 0.305: IC1.1 28.91,27.38 RN3.4
GPB0-2
  Top 0.305: IC2.1 60.91,27.38 RN11.4
GPB1-1
  Top 0.305: RN3.3 26.83,28.6 IC1.2
GPB1-2
  Top 0.305: RN11.3 61.27,28.65 IC2.2
GPB2-1
  Top 0.305: IC1.3 28.08,29.92 28.6,29.4 RN3.2
GPB2-2
  Top 0.305: IC2.3 60.08,29.92 60.6,29.4 RN11.2
GPB3-1
  Top 0.305: IC1.4 28.34,31.19 RN3.1
GPB3-2
  Top 0.305: IC2.4 60.34,31.19 RN11.1
GPB4-1
  Top 0.305: RN4.4 28.48,32.46 IC1.5
GPB4-2
  Top 0.305: IC2.5 60.48,32.46 RN12.4
GPB5-1
  Top 0.305: IC1.6 28.23,33.73 28.6,34.1 RN4.3
GPB5-2
  Top 0.305: IC2.6 60.23,33.73 60.6,34.1 RN12.3
GPB6-1
  Top 0.305: IC1.7 26.88,34.9 RN4.2
GPB6-2
  Top 0.305: RN12.2 58.88,34.9 IC2.7
GPB7-1
  Top 0.305: RN4.1 28.75,36.27 IC1.8
GPB7-2
  Top 0.305: IC2.8 60.76,36.27 RN12.1
N$1
  Top 0.254: R99.2 67.27,48.03 SJ2.1
N$2
  Top 0.254: R100.2 64.23,47.99 SJ1.1
N$3
  Top 0.305: R101.2 11.84,44.16 10.76,45.24 SJ3.1
N$4
  Top 0.254: RN49.8 19.39,51.2 J7.6 22.08,51.19 23.81,51.19 25,50 25,47 19.35,41.35 IC1.17
N$5
  Top 0.254: RN49.7 20.33,50.4 J7.4 22,48.73 22,46 18.62,42.62 IC1.16
N$6
  Top 0.254: J7.2 18.59,49.6 RN49.6
  Top 0.305: J7.2 20.73,45.73 18.89,43.89 IC1.15
N$7
  Top 0.305: LED2.A R97.1
N$8
  Top 0.305: R98.1 LED1.A
N$9
  Top 0.254: J12.2 52.73,45.73 50.89,43.89 IC2.15
  Top 0.305: RN50.6 50.59,49.6 J12.2
N$10
  Top 0.254: IC2.16 50.62,42.62 54,46 54,48.73 J12.4
  Top 0.305: RN50.7 52.33,50.4 J12.4
N$11
  Top 0.254: IC2.17 51.35,41.35 57,47 57,49.98 55.79,51.19 53.81,51.19 52.59,52.41
  Top 0.305: RN50.8 51.39,51.2 52.59,52.41 J12.6
SCL  (via drill 0.5)
  Top 0.254: IC2.12 56.35,41.35 v56,41 | IC1.12 24.35,41.35 v24,41
  Top 0.305: R99.1 v67,41
  Bottom 0.254: J2.1 72,32.73 72,39 70,41 v67,41 v56,41 v24,41 11,41 7,37 7,36 6.19,35.19 4.08,35.19 J1.1
SDA  (via drill 0.5)
  Top 0.254: IC2.13 55.62,42.62 v55,42 | IC1.13 23.62,42.62 v23,42
  Top 0.305: R100.1 v64,42 | 70.54,31.46 68.5,33.5 68.5,41.5 v68,42
  Top 0.406: J2.2 70.54,31.46
  Bottom 0.254: J1.2 10.73,42 v23,42 v55,42 v64,42 v68,42
VCC  (via drill 0.5)
  Top 0.305: RN6.8 RN6.7 RN6.6 RN6.5 RN5.8 RN5.7 RN5.6 RN5.5 9.32,43.67 v9,44 9.24,44.24 SJ3.2 | RN7.5 RN7.6 RN7.7 RN7.8 RN8.5 RN8.6 RN8.7 RN8.8 34.67,37.33 34,38 29,38 | RN14.8 RN14.7 RN14.6 RN14.5 RN13.8 RN13.7 RN13.6 RN13.5 41.33,47.33 v42,48 | R97.2 71,26.5 69.7,27.8 RN15.5 RN15.6 RN15.7 RN15.8 RN16.5 RN16.6 RN16.7 RN16.8 66.67,37.33 66,38 61,38 | IC1.9 28.54,37.54 29,38 | 29,38 C1.1 27.9,49.1 24.46,52.54 J7.5 | IC2.9 60.54,37.54 61,38 | 61,38 C2.1 59.71,49.1 56.27,52.54 J12.5
  Top 0.406: SJ1.2 SJ2.2 67.77,53.27 69,52.04 69,46 73.27,41.73 J2.5
  Bottom 0.305: J7.5 J7.3 J7.1 23.27,46.27 21,44 v9,44 5,44 1,40 1,33 2.54,31.46 J1.5 | J12.1 J12.3 J12.5 | v42,48 42,55
  Bottom 0.406: SJ1.2 62.5,55 56.54,55 55.27,53.73 | J12.5 55.27,53.73 | 55.27,53.73 54,55 42,55 25.73,55 J7.5
VIN  (via drill 0.5)
  Top 0.305: R98.2 v74,24
  Top 0.813: v38,35 v38,36.5 C7.+ v38,43 v38,44.5 | J4.A5 J4.A4 | J4.C5 J4.C4
  pour Bottom: 73,0 arc90 76,3 76,55 arc90 73,58 3,58 arc90 0,55 0,3 arc90 3,0

### Text on the board
tPlace: 8-Port I2C RJ45 Breakout | I2C P/U | by Jon Oxer | A0 | A0 | I2C Addr: / 0x20-27 | A1 | A1 | A2 | A2 | RST P/U | I2C-BREAKOUT | I2C-BREAKOUT | I2CBR | MCP23017 | VCC: 1.8 / to 5.5V / VIN: 12V | MCP23017 | I2CBR | VCC | VIN | Super / House | !INT | v3.0
bPlace: SKU: I2CRJ45X8 | 1K in series with / each data line | Super / House | RJ45 Pinout | !RST | SCL | SDA | www.superhouse.tv | VCC | VIN | GND | GND | VIN | !RST | SDA | VCC | SCL | 8-Port / I2C RJ45 / Breakout | 1: Data 1 / 2: Data 2 / 3: Data 3 / 4: VIN / 5: VIN / 6: Data 4 / 7: GND / 8: GND | by Jon Oxer | Copyright 2019-2021 SuperHouse Automation Pty Ltd / / Released under the terms of the TAPR / Open Hardware License: www.tapr.org/OHL | www.superhouse.tv/i2crj45x8